# EAGLE design mainboard (EAGLE 7.1.0)
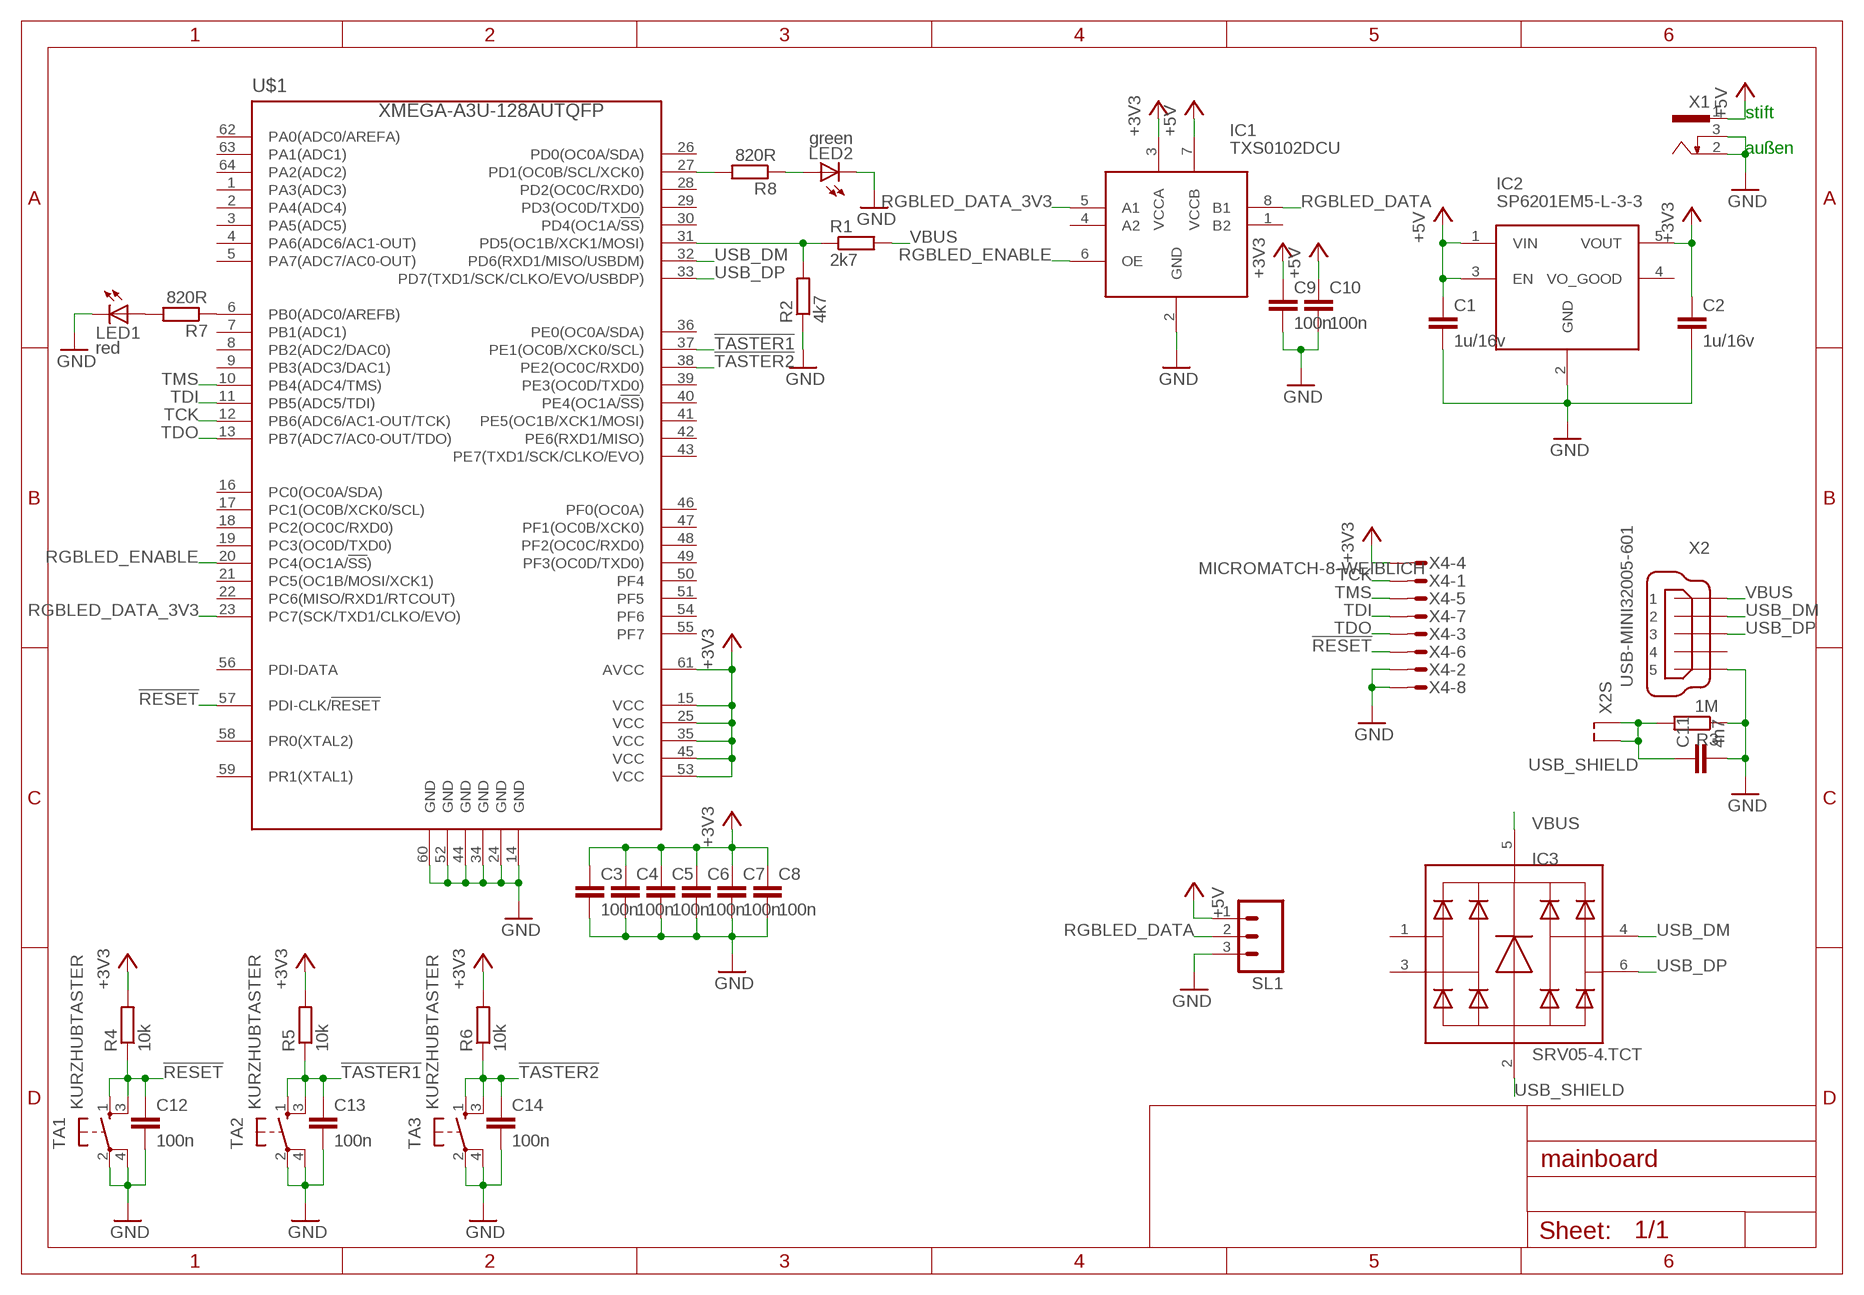
[diagram p0: schematic, sheet 1]

## Parts
C1  1u/16v  C-EUC0603  [C0603]
C2  1u/16v  C-EUC0603  [C0603]
C3  100n  C-EUC0603  [C0603]
C4  100n  C-EUC0603  [C0603]
C5  100n  C-EUC0603  [C0603]
C6  100n  C-EUC0603  [C0603]
C7  100n  C-EUC0603  [C0603]
C8  100n  C-EUC0603  [C0603]
C9  100n  C-EUC0603  [C0603]
C10  100n  C-EUC0603  [C0603]
C11  4n7  C-EUC0603  [C0603]
C12  100n  C-EUC0603  [C0603]
C13  100n  C-EUC0603  [C0603]
C14  100n  C-EUC0603  [C0603]
IC1  TXS0102DCU  [DCU8]
IC2  SP6201EM5-L-3-3  [SOT23-5]
IC3  SRV05-4.TCT  [SOT23-6]
LED1  red  LEDLRCHIPLED_0603  [CHIPLED_0603]
LED2  green  LEDLGCHIPLED_0603  [CHIPLED_0603]
R1  2k7  R-EU_R0603  [R0603]
R2  4k7  R-EU_R0603  [R0603]
R3  1M  R-EU_R0603  [R0603]
R4  10k  R-EU_R0603  [R0603]
R5  10k  R-EU_R0603  [R0603]
R6  10k  R-EU_R0603  [R0603]
R7  820R  R-EU_R0603  [R0603]
R8  820R  R-EU_R0603  [R0603]
SL1  M03  [03P]
TA1  KURZHUBTASTER  [TA93XX]
TA2  KURZHUBTASTER  [TA93XX]
TA3  KURZHUBTASTER  [TA93XX]
U$1  XMEGA-A3U-128AUTQFP  [TQFP64]
X1  733980-62  [733980-62]
X2  USB-MINI32005-601  [32005-601]
X4  MICROMATCH-8-WEIBLICH  [MICROMATCH-8]

## Nets
!RESET!: C12.1 R4.1 TA1.1(S) TA1.3(S1) U$1.57(PDI-CLK/!RESET) X4.6
!TASTER1!: C13.1 R5.1 TA2.1(S) TA2.3(S1) U$1.37(PE1(OC0B/XCK0/SCL))
!TASTER2!: C14.1 R6.1 TA3.1(S) TA3.3(S1) U$1.38(PE2(OC0C/RXD0))
+3V3: C2.1 C3.1 C4.1 C5.1 C6.1 C7.1 C8.1 C9.1 IC1.3(VCCA) IC2.5(VOUT) R4.2 R5.2 R6.2 U$1.15(VCC) U$1.25(VCC) U$1.35(VCC) U$1.45(VCC) U$1.53(VCC) U$1.61(AVCC) X4.4
+5V: C1.1 C10.1 IC1.7(VCCB) IC2.1(VIN) IC2.3(EN) SL1.1 X1.1
GND: C1.2 C2.2 C3.2 C4.2 C5.2 C6.2 C7.2 C8.2 C9.2 C10.2 C11.2 C12.2 C13.2 C14.2 IC1.2(GND) IC2.2(GND) LED1.C LED2.C R2.1 R3.1 SL1.3 TA1.2(P) TA1.4(P1) TA2.2(P) TA2.4(P1) TA3.2(P) TA3.4(P1) U$1.14(GND) U$1.24(GND) U$1.34(GND) U$1.44(GND) U$1.52(GND) U$1.60(GND) X1.2 X1.3 X2.5 X4.2 X4.8
N$1: R1.1 R2.2 U$1.31(PD5(OC1B/XCK1/MOSI))
N$2: R7.1 U$1.6(PB0(ADC0/AREFB))
N$3: LED1.A R7.2
N$4: R8.2 U$1.27(PD1(OC0B/SCL/XCK0))
N$5: LED2.A R8.1
RGBLED_DATA: IC1.8(B1) SL1.2
RGBLED_DATA_3V3: IC1.5(A1) U$1.23(PC7(SCK/TXD1/CLKO/EVO))
RGBLED_ENABLE: IC1.6(OE) U$1.20(PC4(OC1A/!SS!))
TCK: U$1.12(PB6(ADC6/AC1-OUT/TCK)) X4.1
TDI: U$1.11(PB5(ADC5/TDI)) X4.7
TDO: U$1.13(PB7(ADC7/AC0-OUT/TDO)) X4.3
TMS: U$1.10(PB4(ADC4/TMS)) X4.5
USB_DM: IC3.4 U$1.32(PD6(RXD1/MISO/USBDM)) X2.2
USB_DP: IC3.6 U$1.33(PD7(TXD1/SCK/CLKO/EVO/USBDP)) X2.3
USB_SHIELD: C11.1 IC3.2(A) R3.2 X2.M1(S1) X2.M2(S2)
VBUS: IC3.5(K) R1.2 X2.1
Unconnected: IC1.1(B2) IC1.4(A2) IC2.4(VO_GOOD) IC3.1 IC3.3 U$1.1(PA3(ADC3)) U$1.2(PA4(ADC4)) U$1.3(PA5(ADC5)) U$1.4(PA6(ADC6/AC1-OUT)) U$1.5(PA7(ADC7/AC0-OUT)) U$1.7(PB1(ADC1)) U$1.8(PB2(ADC2/DAC0)) U$1.9(PB3(ADC3/DAC1)) U$1.16(PC0(OC0A/SDA)) U$1.17(PC1(OC0B/XCK0/SCL)) U$1.18(PC2(OC0C/RXD0)) U$1.19(PC3(OC0D/TXD0)) U$1.21(PC5(OC1B/MOSI/XCK1)) U$1.22(PC6(MISO/RXD1/RTCOUT)) U$1.26(PD0(OC0A/SDA)) U$1.28(PD2(OC0C/RXD0)) U$1.29(PD3(OC0D/TXD0)) U$1.30(PD4(OC1A/!SS!)) U$1.36(PE0(OC0A/SDA)) U$1.39(PE3(OC0D/TXD0)) U$1.40(PE4(OC1A/!SS!)) U$1.41(PE5(OC1B/XCK1/MOSI)) U$1.42(PE6(RXD1/MISO)) U$1.43(PE7(TXD1/SCK/CLKO/EVO)) U$1.46(PF0(OC0A)) U$1.47(PF1(OC0B/XCK0)) U$1.48(PF2(OC0C/RXD0)) U$1.49(PF3(OC0D/TXD0)) U$1.50(PF4) U$1.51(PF5) U$1.54(PF6) U$1.55(PF7) U$1.56(PDI-DATA) U$1.58(PR0(XTAL2)) U$1.59(PR1(XTAL1)) U$1.62(PA0(ADC0/AREFA)) U$1.63(PA1(ADC1)) U$1.64(PA2(ADC2)) X2.4

## Notes on the sheet
- stift
- außen

## Library data of the parts
C1-C14 = rcl:C-EU: CAPACITOR, European symbol
IC1 = TURAG_misc:TXS0102: I2C/UART-Levelshifter; FARNELL: 1703315
IC2 = TURAG_Spannungsversorgung:SP6201: Linearregler verfügbare Ausgangsspannungen: 1,8V 2,5V 2,895V 3,3V 5,0V; FARNELL: 9388184
IC3 = TURAG_Diode:SRV05-4: SRV05-4.TCT bzw. WE-TVS TVS Diode - High Speed Series; FARNELL: 1456415; WUERTH: 824001
LED1 = led:LED: LED OSRAM: - CHIPLED LG R971, LG N971, LY N971, LG Q971, LY Q971, LO R971, LY R971 LH N974, LH R974 LS Q976, LO Q976, LY Q976 LO Q996 - Hyper CHIPLED LW Q18S LB Q993, LB Q99A, LB R99A - SideLED LS A670, LO A670, LY A670, LG A670, LP A670 LB A673, LV A673, LT A673, LW A673 LH A674 LY A675 LS A676, LA A676, LO A676, LY A676, LW A676 LS A679, LY A679, LG A679 - Hyper Micro SIDELED® LS Y876, LA Y876, LO Y876, LY Y876 LT Y87S - SmartLED LW L88C, LW L88S LB L89C, LB L89S, LG L890 LS L89K, LO L89K, LY L89K LS L896, LA L896, LO L896, LY L896 - TOPLED LS T670, LO T670, LY T670, LG T670, LP T670 LSG T670, LSP T670, LSY T670, LOP T670, LYG T670 LG T671, LOG T671, LSG T671 LB T673, LV T673, LT T673, LW T673 LH T674 LS T676, LA T676, LO T676, LY T676, LB T676, LH T676, LSB T676, LW T676 LB T67C, LV T67C, LT T67C, LS T67K, LO T67K, LY T67K, LW E67C LS E67B, LA E67B, LO E67B, LY E67B, LB E67C, LV E67C, LT E67C LW T67C LS T679, LY T679, LG T679 LS T770, LO T770, LY T770, LG T770, LP T770 LB T773, LV T773, LT T773, LW T773 LH T774 LS E675, LA E675, LY E675, LS T675 LS T776, LA T776, LO T776, LY T776, LB T776 LHGB T686 LT T68C, LB T68C - Hyper Mini TOPLED® LB M676 - Mini TOPLED Santana® LG M470 LS M47K, LO M47K, LY M47K Source: http://www.osram.convergy.de LUXEON: - LUMILED® LXK2-PW12-R00, LXK2-PW12-S00, LXK2-PW14-U00, LXK2-PW14-V00 LXK2-PM12-R00, LXK2-PM12-S00, LXK2-PM14-U00 LXK2-PE12-Q00, LXK2-PE12-R00, LXK2-PE12-S00, LXK2-PE14-T00, LXK2-PE14-U00 LXK2-PB12-K00, LXK2-PB12-L00, LXK2-PB12-M00, LXK2-PB14-N00, LXK2-PB14-P00, LXK2-PB14-Q00 LXK2-PR12-L00, LXK2-PR12-M00, LXK2-PR14-Q00, LXK2-PR14-R00 LXK2-PD12-Q00, LXK2-PD12-R00, LXK2-PD12-S00 LXK2-PH12-R00, LXK2-PH12-S00 LXK2-PL12-P00, LXK2-PL12-Q00, LXK2-PL12-R00 Source: www.luxeon.com KINGBRIGHT: KA-3528ASYC Source: www.kingbright.com; FARNELL: 1685068; REICHELT: LS L29K
LED2 = led:LED: LED OSRAM: - CHIPLED LG R971, LG N971, LY N971, LG Q971, LY Q971, LO R971, LY R971 LH N974, LH R974 LS Q976, LO Q976, LY Q976 LO Q996 - Hyper CHIPLED LW Q18S LB Q993, LB Q99A, LB R99A - SideLED LS A670, LO A670, LY A670, LG A670, LP A670 LB A673, LV A673, LT A673, LW A673 LH A674 LY A675 LS A676, LA A676, LO A676, LY A676, LW A676 LS A679, LY A679, LG A679 - Hyper Micro SIDELED® LS Y876, LA Y876, LO Y876, LY Y876 LT Y87S - SmartLED LW L88C, LW L88S LB L89C, LB L89S, LG L890 LS L89K, LO L89K, LY L89K LS L896, LA L896, LO L896, LY L896 - TOPLED LS T670, LO T670, LY T670, LG T670, LP T670 LSG T670, LSP T670, LSY T670, LOP T670, LYG T670 LG T671, LOG T671, LSG T671 LB T673, LV T673, LT T673, LW T673 LH T674 LS T676, LA T676, LO T676, LY T676, LB T676, LH T676, LSB T676, LW T676 LB T67C, LV T67C, LT T67C, LS T67K, LO T67K, LY T67K, LW E67C LS E67B, LA E67B, LO E67B, LY E67B, LB E67C, LV E67C, LT E67C LW T67C LS T679, LY T679, LG T679 LS T770, LO T770, LY T770, LG T770, LP T770 LB T773, LV T773, LT T773, LW T773 LH T774 LS E675, LA E675, LY E675, LS T675 LS T776, LA T776, LO T776, LY T776, LB T776 LHGB T686 LT T68C, LB T68C - Hyper Mini TOPLED® LB M676 - Mini TOPLED Santana® LG M470 LS M47K, LO M47K, LY M47K Source: http://www.osram.convergy.de LUXEON: - LUMILED® LXK2-PW12-R00, LXK2-PW12-S00, LXK2-PW14-U00, LXK2-PW14-V00 LXK2-PM12-R00, LXK2-PM12-S00, LXK2-PM14-U00 LXK2-PE12-Q00, LXK2-PE12-R00, LXK2-PE12-S00, LXK2-PE14-T00, LXK2-PE14-U00 LXK2-PB12-K00, LXK2-PB12-L00, LXK2-PB12-M00, LXK2-PB14-N00, LXK2-PB14-P00, LXK2-PB14-Q00 LXK2-PR12-L00, LXK2-PR12-M00, LXK2-PR14-Q00, LXK2-PR14-R00 LXK2-PD12-Q00, LXK2-PD12-R00, LXK2-PD12-S00 LXK2-PH12-R00, LXK2-PH12-S00 LXK2-PL12-P00, LXK2-PL12-Q00, LXK2-PL12-R00 Source: www.luxeon.com KINGBRIGHT: KA-3528ASYC Source: www.kingbright.com; REICHELT: LG L29K
R1-R8 = rcl:R-EU_: RESISTOR, European symbol
SL1 = con-amp-quick:M03: AMP QUICK CONNECTOR; REICHELT: PSS 254/3G:PSK 254/3W
TA1-TA3 = TURAG_Schalter-Relais:KURZHUBTASTER; REICHELT: Taster 9314; WUERTH: 430 182 043 816
U$1 = atmel:XMEGA-A3U: Atmel XMega A3 series processor; FARNELL: 2066298
X1 = con-conrad:73398?: FEMALE PRINT CONNECTOR Niedervolt-Steckverbinder Distributor Conrad; REICHELT: HEBW 21
X2 = TURAG_Steckverbinder:USB-MINI: MINI USB-B R/A DIP 5pol. Source: www.cypressindustries.com; REICHELT: USB BWM
X4 = con-amp-micromatch:MICROMATCH-8: MicroMaTch 8 7-215464-8 / 0-215464-8 Drawing Number C-215464 DDEController.pdf; REICHELT: MM FL 8G:MM SL 8SK

## Board
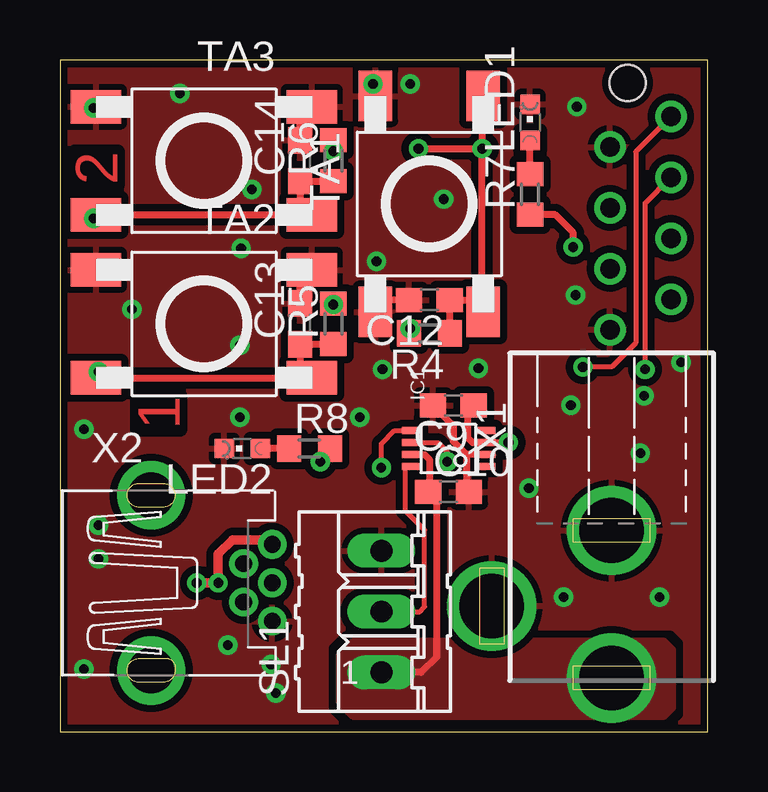
[diagram p1: board, top side]
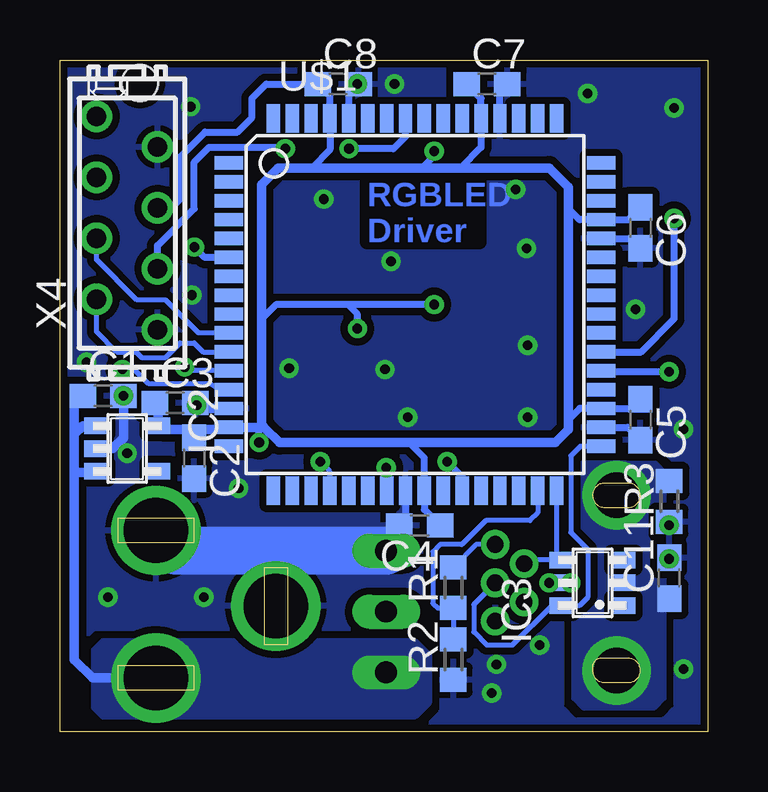
[diagram p2: board, bottom side, seen from below]

Size 27 x 28 mm. Coordinates in mm from the lower left corner, seen from the top.
Outline: 0,0 27,0 27,28 0,28 0,0
Copper layers (1*16): Top 0.035mm / dielectric 1.6mm / Bottom 0.035mm
Design rules "default": minimum track width 0.2mm, minimum drill 0.4mm, track to track 0.2mm, track to pad 0.2mm, pad to pad 0.2mm, via to via 0.2mm, smd to smd 0mil, copper to edge 0.2mm, drill to drill 0.2mm, minimum pad ring 0.25mm, minimum via ring 0.2mm, stop-mask expansion 4mil, vias tented up to drill 0.5mm, thermal gap 10mil

### Footprints (pad centres in the part's own frame; a part is rotated, then mirrored left to right if it is on the bottom)
C0603 = smd 1.1 x 1: 1 -0.85,0; 2 0.85,0
DCU8 = smd 0.3 x 0.8: 1 -0.75,-1.55; 2 -0.25,-1.55; 3 0.25,-1.55; 4 0.75,-1.55; 5 0.75,1.55; 6 0.25,1.55; 7 -0.25,1.55; 8 -0.75,1.55
SOT23-5 = smd 0.69 x 0.99: 1 -0.95,-1.29; 2 0,-1.29; 3 0.95,-1.29; 4 0.95,1.3; 5 -0.95,1.3
SOT23-6 = smd 0.69 x 0.99: 1 -0.95,-1.29; 2 0,-1.29; 3 0.95,-1.29; 4 0.95,1.3; 5 0,1.29; 6 -0.95,1.3
CHIPLED_0603 = smd 0.8 x 0.8: A 0,-0.75; C 0,0.75
R0603 = smd 1 x 1.1: 1 -0.85,0; 2 0.85,0
03P = drill 0.914 long: 1 -2.54,0; 2 0,0; 3 2.54,0
TA93XX = smd 2.1 x 1.4: 1 4.5,2.25; 2 4.5,-2.25; 3 -4.5,2.25; 4 -4.5,-2.25
TQFP64 = smd 1.194 x 0.559: 1 -7.76,5.905; 2 -7.76,5.118; 3 -7.76,4.331; 4 -7.76,3.543; 5 -7.76,2.756; 6 -7.76,1.968; 7 -7.76,1.181; 8 -7.76,0.394; 9 -7.76,-0.394; 10 -7.76,-1.181; 11 -7.76,-1.968; 12 -7.76,-2.756; 13 -7.76,-3.543; 14 -7.76,-4.331; 15 -7.76,-5.118; 16 -7.76,-5.905; 33 7.76,-5.905; 34 7.76,-5.118; 35 7.76,-4.331; 36 7.76,-3.543; 37 7.76,-2.756; 38 7.76,-1.968; 39 7.76,-1.181; 40 7.76,-0.394; 41 7.76,0.394; 42 7.76,1.181; 43 7.76,1.968; 44 7.76,2.756; 45 7.76,3.543; 46 7.76,4.331; 47 7.76,5.118; 48 7.76,5.905 | smd 0.559 x 1.194: 17 -5.905,-7.76; 18 -5.118,-7.76; 19 -4.331,-7.76; 20 -3.543,-7.76; 21 -2.756,-7.76; 22 -1.968,-7.76; 23 -1.181,-7.76; 24 -0.394,-7.76; 25 0.394,-7.76; 26 1.181,-7.76; 27 1.968,-7.76; 28 2.756,-7.76; 29 3.543,-7.76; 30 4.331,-7.76; 31 5.118,-7.76; 32 5.905,-7.76; 49 5.905,7.76; 50 5.118,7.76; 51 4.331,7.76; 52 3.543,7.76; 53 2.756,7.76; 54 1.968,7.76; 55 1.181,7.76; 56 0.394,7.76; 57 -0.394,7.76; 58 -1.181,7.76; 59 -1.968,7.76; 60 -2.756,7.76; 61 -3.543,7.76; 62 -4.331,7.76; 63 -5.118,7.76; 64 -5.905,7.76
733980-62 = drill 2.7: 1 0,8.57; 2 0,2.42; 3 5,5.57
32005-601 = drill 0.7 pad 1.016: 1 5.05,1.6; 2 3.85,0.8; 3 5.05,0; 4 3.85,-0.8; 5 5.05,-1.6 | drill 1.9: M1 0,3.65; M2 0,-3.65
MICROMATCH-8 = drill 0.813: 1 4.445,1.27; 2 3.175,-1.27; 3 1.905,1.27; 4 0.635,-1.27; 5 -0.635,1.27; 6 -1.905,-1.27; 7 -3.175,1.27; 8 -4.445,-1.27 | hole 1.5: 5.845,-0.53

### Placement (x,y rotation side)
C1  25.2,14 0 bottom
C2  21.4,11.4 270 bottom
C3  22.2,13.7 0 bottom
C4  12,8.6 180 bottom
C5  2.8,13 270 bottom
C6  2.8,21 270 bottom
C7  9.2,27 0 bottom
C8  15.4,27 0 bottom
C9  16.4,13.6 180 top
C10  16.2,10 0 top
C11  1.6,6.4 90 bottom
C12  15.4,18 180 top
C13  10,17 90 top
C14  10,23.8 90 top
IC1  16.2,11.8 90 top
IC2  24.2,11.8 270 bottom
IC3  4.8,6.2 90 bottom
LED1  19.6,25.4 0 top
LED2  7.6,11.8 90 top
R1  10.6,6 90 bottom
R2  10.6,3 90 bottom
R3  1.6,9.6 90 bottom
R4  15.4,16.6 180 top
R5  11.4,17 90 top
R6  11.4,23.8 90 top
R7  19.6,22.4 90 top
R8  10.4,11.8 0 top
SL1  13.4,5 90 top
TA1  15.4,22 270 top
TA2  6,17 180 top
TA3  6,23.8 180 top
U$1  12.2,17.8 0 bottom
X1  23,10.8 180 top
X2  3.8,6.2 0 top
X4  24.2,21.2 90 bottom

### Tracks (layer width: path | path; a pad name or v marks a point on that pad's centre or on a via)
!RESET!  (via drill 0.4)
  Top 0.2: TA1.3 17.6,26.45 | TA1.1 17.6,17.55 17.6,18
  Top 0.3: v14.95,24.3 v17.6,24.3 | 17.6,26.45 v17.6,24.3 | v17.6,24.3 17.6,18 C12.1 R4.1
  Bottom 0.3: X4.6 22.93,20.27 21.4,21.8 21.4,23.75 20.8,24.35 17.65,24.35 v17.6,24.3 | U$1.57 12.59,24.81 13.1,24.3 v14.95,24.3
!TASTER1!  (via drill 0.4)
  Top 0.3: R5.1 C13.1 10,15.25 TA2.3 TA2.1 1.5,14.9 v1.6,15
  Bottom 0.3: v1.6,15 4.4,15 U$1.37
!TASTER2!  (via drill 0.4)
  Top 0.3: 10,21.55 TA3.1 1.4,21.45 v1.4,21.4 | 10,21.55 TA3.3 | 10,21.55 C14.1 R6.1
  Bottom 0.3: U$1.38 2.77,15.83 1.4,17.2 v1.4,21.4
+3V3  (via drill 0.4)
  Top 0.3: C9.1 17,13.35 17,12.25 17.2,12.05 IC1.3 v18.7,12.05 | R6.2 v11.4,24.2 | R5.2 v11.4,17.8 | R4.2 14.55,16.75 v14.6,16.8
  Bottom 0.3: C4.1 11.81,9.26 U$1.25 11.81,11.41 12.45,12.05 | C5.1 3.18,13.47 U$1.35 5.33,13.47 5.8,13 | C6.1 3.31,21.34 U$1.45 5.34,21.34 5.8,21.8 | C7.1 9.44,26.39 U$1.53 9.44,24.36 10.3,23.5 | v18.7,12.05 18.7,12.68 | 16.5,23.5 15.74,24.26 U$1.61 15.74,26.49 C8.1 18.4,27 19,26.4 19,25.6 19.6,25 20.95,25 22,23.95 22,22.2 22.36,21.84 X4.4 | v11.4,24.2 11.4,24 11.9,23.5 | v11.4,17.8 15,17.8 | 15,17.8 18,17.8 18.6,17.2 | v14.6,16.8 14.6,17.4 15,17.8
  Bottom 0.4: C3.1 22.9,13.55 IC2.5 22.75,12.6 21.75,12.6 C2.1 21.05,12.6 20.18,12.6 20.03,12.75 U$1.15 18.7,12.68 18.48,12.68 | 18.48,12.68 17.85,12.05 12.45,12.05 6.35,12.05 5.8,12.6 5.8,13 5.8,21.8 5.8,22.7 6.6,23.5 10.3,23.5 11.9,23.5 16.5,23.5 17.9,23.5 18.6,22.8 18.6,17.2 18.6,12.8 18.48,12.68
+5V
  Top 0.3: IC1.7 15.2,11.55 15.4,11.35 15.4,10.05 C10.1 15.7,9.65 15.7,3.1 15.06,2.46 SL1.1
  Bottom 0.4: IC2.1 26.05,12.75 26.4,12.4 | 26.4,12.4 26.4,10.8 | 26.4,10.8 26.4,3 25.63,2.23 X1.1 | IC2.3 25.54,10.8 26.4,10.8 | C1.1 26.4,13.65 26.4,12.4
  pour Bottom (isolate 0.3, no thermals): 12.2,0.6 25.2,0.6 25.6,1 25.6,3.4 25.2,3.8 12.2,3.8 11.6,3.2 11.6,1.2
  pour Top (isolate 0.3, no thermals): 25.2,3.8 12.2,3.8 11.6,3.2 11.6,1.2 12.2,0.6 25.2,0.6 25.6,1 25.6,3.4
GND  (via drill 0.4)
  Top 0.2: 13.65,18 TA1.2
  Top 0.3: C9.2 16.4,12.75 16.4,12.1 16.95,11.55 | IC1.2 16.95,11.55 | C12.2 13.65,18 | C14.2 10,25.55 TA3.4 | C13.2 10,18.75 TA2.4 | 16.95,11.55 16.95,10.2
  Bottom 0.3: U$1.60 14.96,26.59 C8.2 | U$1.24 12.59,8.86 C4.2 | U$1.34 3.33,12.68 C5.2 | U$1.44 3.21,20.56 C6.2 | U$1.52 8.66,26.69 C7.2
  Bottom 0.4: U$1.14 21.12,13.47 C3.2 | C1.2 24.35,12.25 24.8,11.8 IC2.2
  Bottom 2: SL1.3 18,7.54 | 18,7.54 22.16,7.54 X1.2 | X1.3 18,7.54
  other vias: 25,5.6 21,5.6 9,1.6 7,3.6 1,2.6 1,12.6 7.5,13.1 12.5,13.1 13.45,15.1 17.45,15.15 7.5,16.1 7.55,20.15 3,17.6 1.4,26 8,22.6 13.2,19.6 16,22.2 21.5,18.2 24.35,14 24.2,11.6 21.3,13.6 19.55,10.15 21.55,26.05 14.6,27 13.05,27 5,26.6 25.9,15.4 8.8,2.8 1.6,7.2 1.6,8.6
  pour Bottom (isolate 0.3, rank 2): 0,28 0,0 27,0 27,28
  pour Top (isolate 0.3, rank 2): 0,28 0,0 27,0 27,28
N$1
  Bottom 0.2: U$1.31 7.08,9.12 7.4,8.8 9.25,8.8 10.25,7.8 11.15,7.8 11.45,7.5 11.45,5.35 11.25,5.15 R1.1 R2.2
N$2  (via drill 0.4)
  Top 0.3: v21.4,20.2 21.4,20.8 20.65,21.55 R7.1
  Bottom 0.3: U$1.6 20.97,19.77 v21.4,20.2
N$3
  Top 0.3: R7.2 LED1.A
N$4  (via drill 0.4)
  Top 0.3: R8.2 11.25,11.65 v10.85,11.25
  Bottom 0.3: U$1.27 10.23,10.63 v10.85,11.25
N$5
  Top 0.3: R8.1 LED2.A
RGBLED_DATA
  Top 0.2: SL1.2 15,5 15.2,5.2 15.2,8.4 14.4,9.2 14.4,11 14.45,11.05 IC1.8
RGBLED_DATA_3V3  (via drill 0.4)
  Top 0.2: v13.4,11 13.4,12 13.95,12.55 IC1.5
  Bottom 0.2: U$1.23 13.38,10.98 v13.4,11
RGBLED_ENABLE  (via drill 0.4)
  Top 0.2: IC1.6 15.75,12.05 16.15,11.65 v16.15,11.25
  Bottom 0.2: U$1.20 15.74,10.84 v16.15,11.25
TCK  (via drill 0.4)
  Top 0.2: X4.1 24,24.18 24,16.2 23,15.2 v21.8,15.2
  Bottom 0.2: U$1.12 21.64,15.04 v21.8,15.2
TDI
  Bottom 0.2: X4.7 25.47,16.67 24.63,15.83 23.83,15.83 23.6,15.6 22.6,15.6 22,16.2 21.4,16.2 21.03,15.83 U$1.11
TDO  (via drill 0.4)
  Top 0.2: v24.4,15.1 24.4,22.04 X4.3
  Bottom 0.2: v24.4,15.1 23.9,15.1 23.3,14.5 20.7,14.5 20.36,14.26 U$1.13
TMS
  Bottom 0.2: U$1.10 21.22,16.62 22.6,18 23.8,18 25.47,19.67 X4.5
USB_DM
  Bottom 0.2: U$1.32 6.29,7.34 IC3.4 7.5,7.15 X2.2
USB_DP
  Bottom 0.2: X2.3 9.75,5.3 9.75,4.15 9.2,3.6 8.15,3.6 6.5,5.25 IC3.6 5.35,5.25 5,5.6 5,7.6 5.7,8.3 5.7,11.5 5.31,11.89 U$1.33
USB_SHIELD
  pour Bottom (isolate 0.3, no thermals): 1.8,1.4 1.8,10.8 2.2,11.2 5.2,11.2 5.6,10.8 5.6,1.4 5.2,1 2.2,1
VBUS  (via drill 0.4)
  Top 0.4: X2.1 8.65,8 7.2,8 6.6,7.4 v6.6,6.2 v5.7,6.2
  Bottom 0.2: IC3.5 v5.7,6.2 | X2.1 9.65,7.8 R1.2
  Bottom 0.4: v6.6,6.2 v5.7,6.2

### Text on the board
Top: 2 | 1
Bottom: RGBLED / Driver